# Altium schematic sheet Precharge.SchDoc
size A3; SheetNumber: 7; SheetTotal: 10
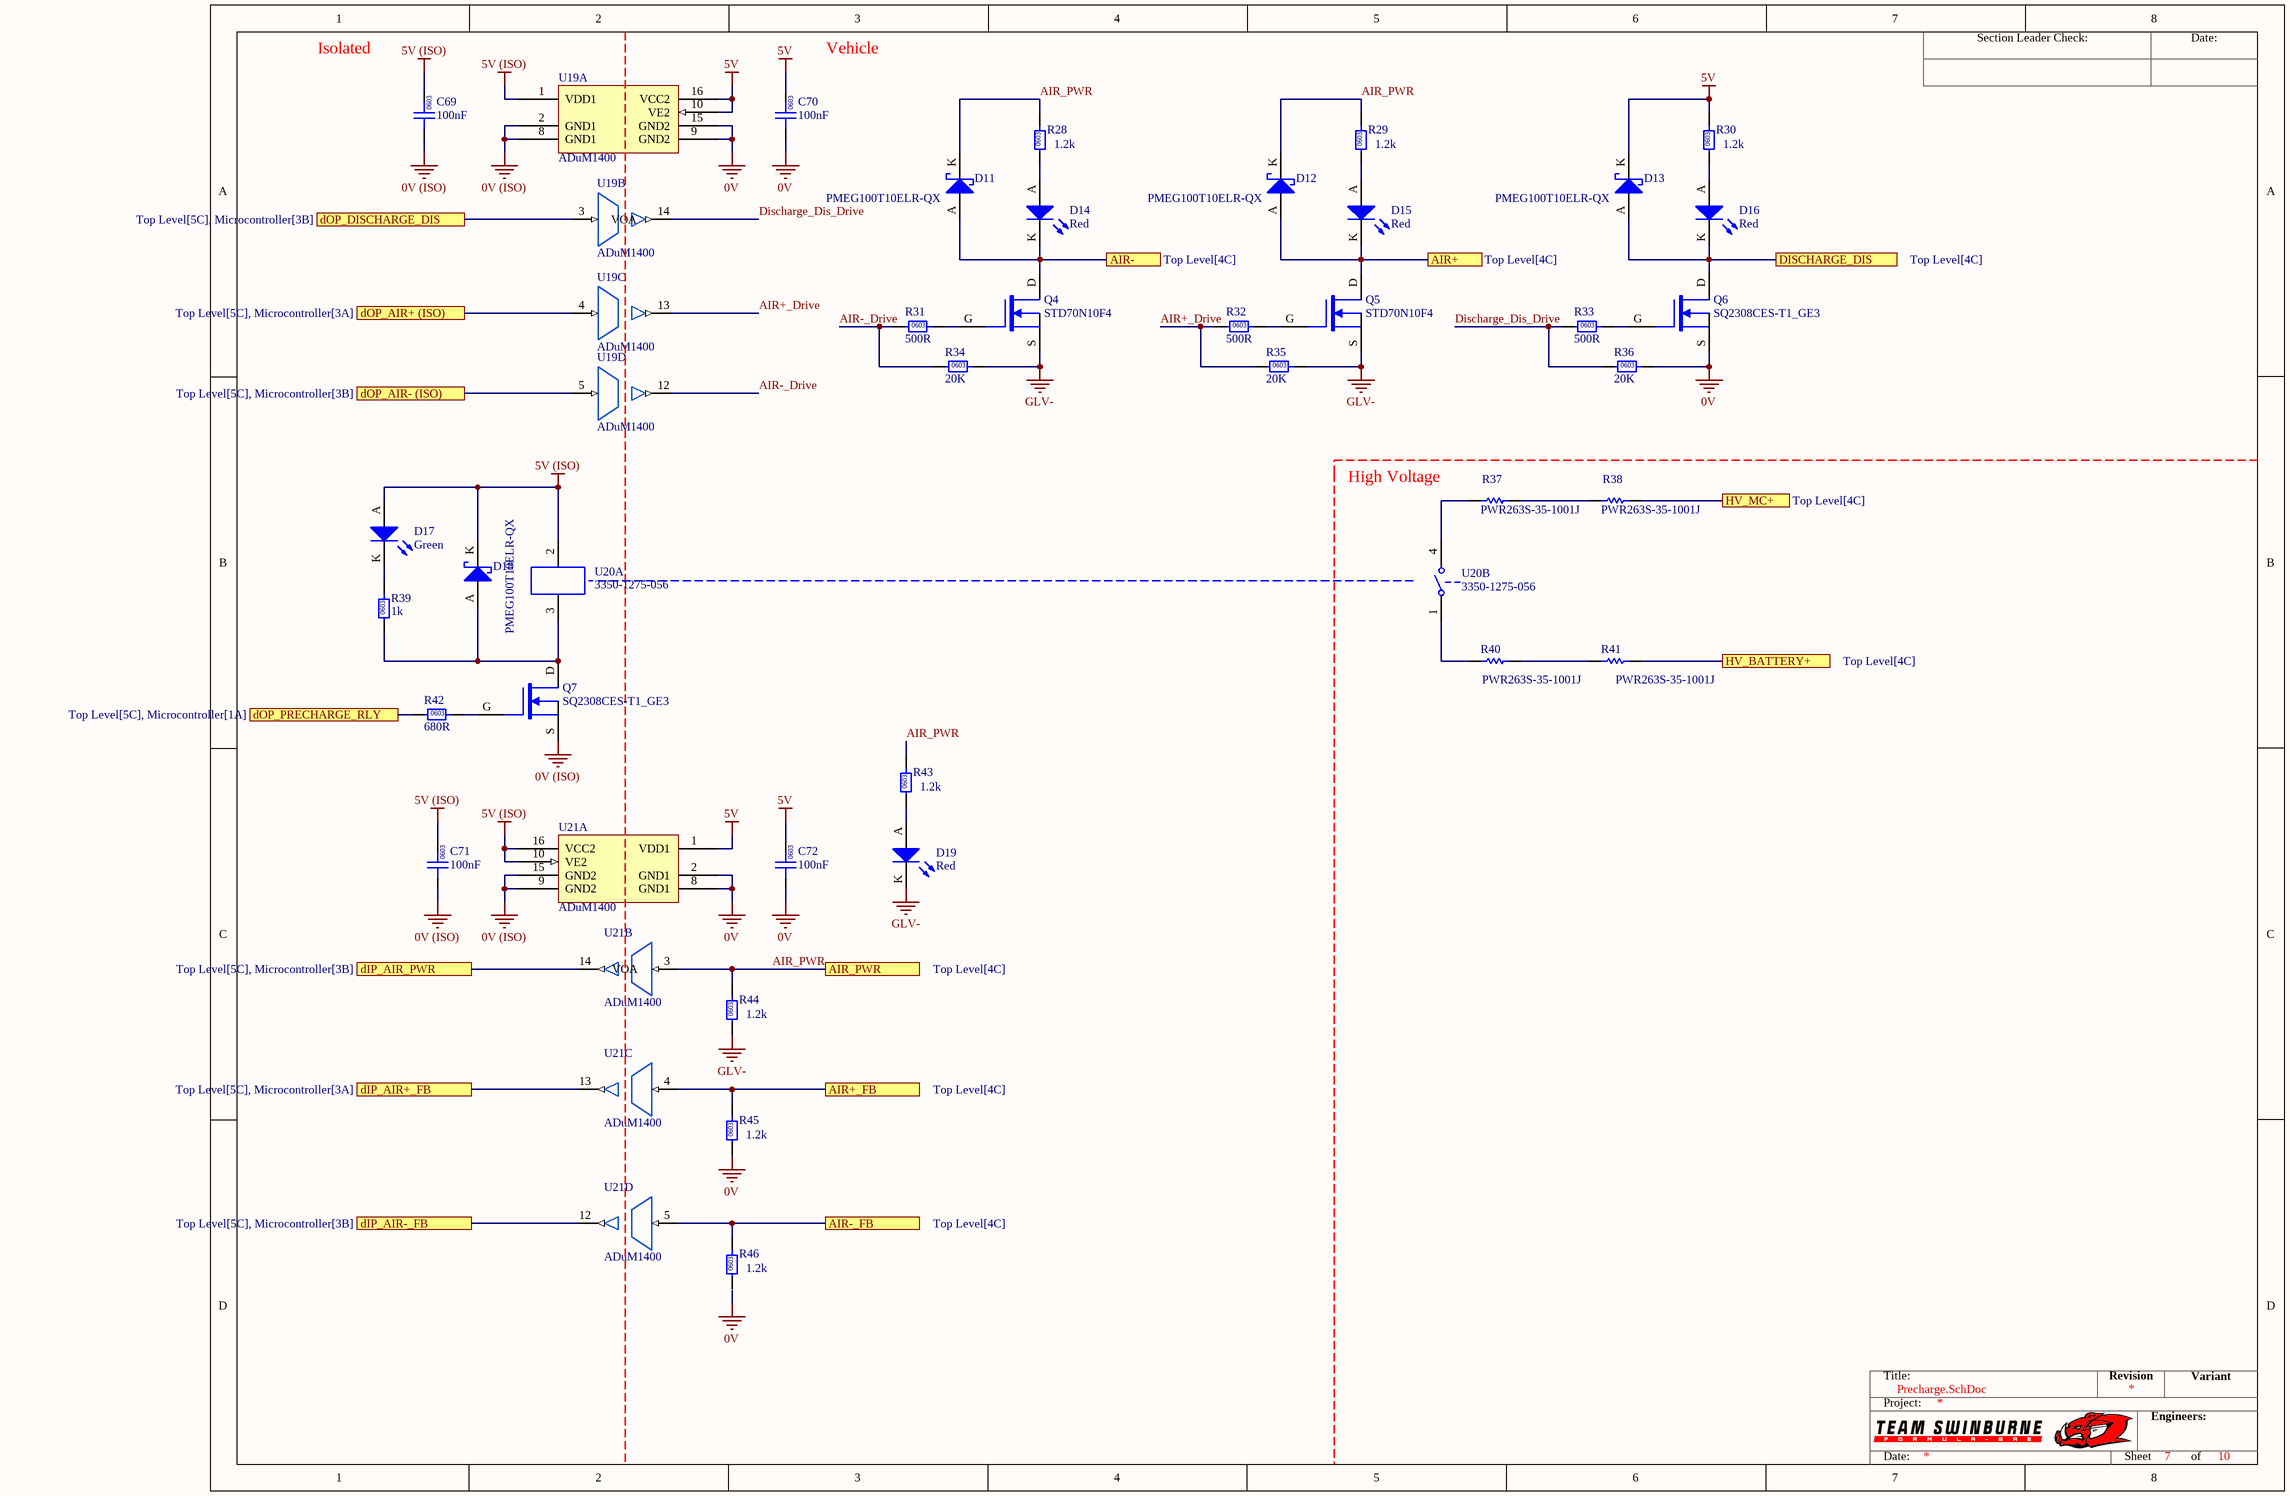
[diagram p0: Precharge.SchDoc]

## Parts
C69  100nF  [0603]
C70  100nF  [0603]
C71  100nF  [0603]
C72  100nF  [0603]
D11  PMEG100T10ELR-QX  [NXP SOD123W]
D12  PMEG100T10ELR-QX  [NXP SOD123W]
D13  PMEG100T10ELR-QX  [NXP SOD123W]
D14  Red  [0805 LED]
D15  Red  [0805 LED]
D16  Red  [0805 LED]
D17  Green  [0805 LED]
D18  PMEG100T10ELR-QX  [NXP SOD123W]
D19  Red  [0805 LED]
Q4  STD70N10F4  [STM TO-252 MOSFET]
Q5  STD70N10F4  [STM TO-252 MOSFET]
Q6  SQ2308CES-T1_GE3  [VSHY SOT-23-3]
Q7  SQ2308CES-T1_GE3  [VSHY SOT-23-3]
R28  1.2k  [0603]
R29  1.2k  [0603]
R30  1.2k  [0603]
R31  500R  [0603]
R32  500R  [0603]
R33  500R  [0603]
R34  20K  [0603]
R35  20K  [0603]
R36  20K  [0603]
R37  PWR263S-35-1001J  [B TO-263]
R38  PWR263S-35-1001J  [B TO-263]
R39  1k  [0603]
R40  PWR263S-35-1001J  [B TO-263]
R41  PWR263S-35-1001J  [B TO-263]
R42  680R  [0603]
R43  1.2k  [0603]
R44  1.2k  [0603]
R45  1.2k  [0603]
R46  1.2k  [0603]
U19  ADuM1400  [AD 16-SOIC]  (parts A,B,C,D of 5)
U20  3350-1275-056  [CI SPST]  (parts A,B of 2)
U21  ADuM1400  [AD 16-SOIC]  (parts A,B,C,D of 5)

## Ports
AIR+ (see Top Level[4C]), AIR+_FB (see Top Level[4C]), AIR- (see Top Level[4C]), AIR-_FB (see Top Level[4C]), AIR_PWR (see Top Level[4C]), dIP_AIR+_FB (see Top Level[5C], Microcontroller[3A]), dIP_AIR-_FB (see Top Level[5C], Microcontroller[3B]), dIP_AIR_PWR (see Top Level[5C], Microcontroller[3B]), DISCHARGE_DIS (see Top Level[4C]), dOP_AIR+ (ISO) (see Top Level[5C], Microcontroller[3A]), dOP_AIR- (ISO) (see Top Level[5C], Microcontroller[3B]), dOP_DISCHARGE_DIS (see Top Level[5C], Microcontroller[3B]), dOP_PRECHARGE_RLY (see Top Level[5C], Microcontroller[1A]), HV_BATTERY+ (see Top Level[4C]), HV_MC+ (see Top Level[4C])

## Nets
0V: C70.1 C72.1 Q6.S R36.2 R45.1 U19.9(GND2) U19.15(GND2) U21.2(GND1) U21.8(GND1)
0V (ISO): C69.1 C71.1 Q7.S U19.2(GND1) U19.8(GND1) U21.9(GND2) U21.15(GND2)
5V: C70.2 C72.2 D13.K R30.2 U19.10(VE2) U19.16(VCC2) U21.1(VDD1)
5V (ISO): C69.2 C71.2 D17.A D18.K U19.1(VDD1) U20.2 U21.10(VE2) U21.16(VCC2)
GLV-: D19.K Q4.S Q5.S R34.2 R35.2 R44.1
AIR+: D12.A D15.K Q5.D ; port AIR+
AIR+_Drive: R32.1 R35.1 U19.13(VOB)
AIR+_FB: R45.2 U21.4(VIB) ; port AIR+_FB
AIR-: D11.A D14.K Q4.D ; port AIR-
AIR-_Drive: R31.1 R34.1 U19.12(VOC)
AIR-_FB: R46.2 U21.5(VIC) ; port AIR-_FB
AIR_PWR: D11.K D12.K R28.2 R29.2 R43.2 R44.2 U21.3(VIA) ; port AIR_PWR
dIP_AIR+_FB: U21.13(VOB) ; port dIP_AIR+_FB
dIP_AIR-_FB: U21.12(VOC) ; port dIP_AIR-_FB
dIP_AIR_PWR: U21.14(VOA) ; port dIP_AIR_PWR
DISCHARGE_DIS: D13.A D16.K Q6.D ; port DISCHARGE_DIS
Discharge_Dis_Drive: R33.1 R36.1 U19.14(VOA)
dOP_AIR+ (ISO): U19.4(VIB) ; port dOP_AIR+ (ISO)
dOP_AIR- (ISO): U19.5(VIC) ; port dOP_AIR- (ISO)
dOP_DISCHARGE_DIS: U19.3(VIA) ; port dOP_DISCHARGE_DIS
dOP_PRECHARGE_RLY: R42.1 ; port dOP_PRECHARGE_RLY
HV_BATTERY+: R41.1 ; port HV_BATTERY+
HV_MC+: R38.2 ; port HV_MC+
NetD14_A: D14.A R28.1
NetD15_A: D15.A R29.1
NetD16_A: D16.A R30.1
NetD17_K: D17.K R39.2
NetD18_A: D18.A Q7.D R39.1 U20.3
NetD19_A: D19.A R43.1
NetQ4_G: Q4.G R31.2
NetQ5_G: Q5.G R32.2
NetQ6_G: Q6.G R33.2
NetQ7_G: Q7.G R42.2
NetR37_1: R37.1 U20.4
NetR37_2: R37.2 R38.1
NetR40_1: R40.1 R41.2
NetR40_2: R40.2 U20.1

Not connected (* = marked no-connect by the designer): R46 1

## Notes on the sheet
- Isolated
- Vehicle
- (near R37) High Voltage
- Section Leader Check:
- Date:
- Title:
- Revision
- Variant
- Project:
- Engineers:
- Sheet
- of
- (in symbol GCM188L81H104KA57D) 0603
- (in symbol RC0603FR-071KL) 0603
- (in symbol RC0603FR-0720KL) 0603
- (in symbol RC0603JR-071K2L) 0603
- (in symbol RC0603JR-13680RL) 0603
- (in symbol RT0603BRD07500RL) 0603

## Library data of the parts
C69-C72 = GCM188L81H104KA57D: Manufacturer: muRata; Rated Voltage: 50V; Tolerance: ±10%; Material: MLCC; Temperature Rating: X8L; Part Number: GCM188L81H104KA57D; Value: 100nF; Digikey Part Number: 490-6049-1-ND
D11-D13 D18 = PMEG100T10ELR-QX: Manufacturer: Nexperia USA Inc.; Forward Voltage: 0.75 V @ 1A; Breakdown Voltage: 100 V; Rated Power: 680 mW; Part Number: PMEG100T10ELR-QX; Digikey Part Number: 1727-PMEG100T10ELR-QXCT-ND
D14-D16 D19 = SML-210LTT86: Red LED Indication - Discrete 1.75V 0805 (2012 Metric); Manufacturer: ROHM Semiconductor; Part Number: SML-210LTT86; Colour: Red; Digikey Part Number: 511-1286-1-ND
D17 = SML-210FTT86: Green LED Indication - Discrete 1.75V 0805 (2012 Metric); Manufacturer: ROHM Semiconductor; Part Number: SML-210FTT86; Colour: Green; Digikey Part Number: 511-1285-1-ND; Digikey Link: https://www.digikey.com/product-detail/en/rohm-semiconductor/SML-210FTT86/511-1285-1-ND/637098
Q4 Q5 = STD70N10F4: N-Channel 100V 60A (Tc) 125W (Tc) Surface Mount DPAK; Manufacturer: STMicroelectronics; Published: 24-Mar-1999; LatestRevisionDate: 29-May-2009; LatestRevisionNote: IPC-7351 Footprint Added.; PackageVersion: Sep-2000; PackageReference: SOT-343; Publisher: Altium Limited; PackageDescription: 4-Pin SOT-343 Package 1.3 mm Pitch, 2.1 mm Lead Span; Part Number: STD70N10F4; Type: N-channel; Rated Power: 125W; Digikey Part Number: 497-8806-2-ND
Q6 Q7 = SQ2308CES-T1_GE3: MOSFET N-CH 60V 2.3A SOT23; Manufacturer: Vishay Siliconix; Type: N-channel; Rated Power: 2W; Published: 24-Mar-1999; LatestRevisionDate: 29-May-2009; LatestRevisionNote: IPC-7351 Footprint Added.; PackageVersion: Sep-2000; PackageReference: SOT-343; Publisher: Altium Limited; PackageDescription: 4-Pin SOT-343 Package 1.3 mm Pitch, 2.1 mm Lead Span; Part Number: SQ2308CES-T1_GE3; Digikey Part Number: SQ2308CES-T1_GE3CT-ND
R28-R30 R43-R46 = RC0603JR-071K2L: Manufacturer: YAGEO; Tolerance: 0.01; Rated Power: 0.1W; Part Number: RC0603JR-071K2L; Value: 1.2k; Material: FR-07; Digikey Part Number: 311-1.2KGRCT-ND
R31-R33 = RT0603BRD07500RL: Manufacturer: YAGEO; Tolerance: 0.01; Rated Power: 0.1W; Part Number: RT0603BRD07500RL; Value: 500R; Material: FR-07; Digikey Part Number: 13-RT0603BRD07500RL-ND
R34-R36 = RC0603FR-0720KL: Manufacturer: YAGEO; Tolerance: 0.01; Rated Power: 0.1W; Part Number: RC0603FR-0720KL; Value: 20K; Material: FR-07; Digikey Part Number: 311-20.0KHRCT-ND
R37 R38 R40 R41 = CMP-037-000402-1: Manufacturer: Bournes Inc; Value: 1k; Rated Voltage: 35W; Tolerance: 0.05; Part Number: PWR263S-35-1001J; Digikey Part Number: PWR263S-35-1001J-ND
R39 = RC0603FR-071KL: Manufacturer: YAGEO; Tolerance: 0.01; Rated Power: 0.1W; Part Number: RC0603FR-071KL; Value: 1k; Material: FR-07; Digikey Part Number: 311-1.00KHRCT-ND
R42 = RC0603JR-13680RL: Manufacturer: YAGEO; Tolerance: 0.01; Rated Power: 0.1W; Part Number: RC0603JR-13680RL; Value: 680R; Material: FR-07; Digikey Part Number: 13-RC0603JR-13680RLCT-ND
U19 U21 = ADuM1400: General Purpose Digital Isolator 2500Vrms 4 Channel 1Mbps 25kV/µs CMTI 16-SOIC (0.295", 7.50mm Width); Manufacturer: Analog Devices; Part Number: ADuM1400; Digikey Part Number: ADUM1400WSRWZ-ND; Digikey Link: https://www.digikey.com/product-detail/en/analog-devices-inc/ADUM1400WSRWZ/ADUM1400WSRWZ-ND/1873713
U20 = 3350-1275-056: RELAY REED HV SPST 200W 3A 5V (NO); Manufacturer: Comus International; Part Number: 3350-1275-056; Digikey Part Number: 1835-1036-ND; Digikey Link: https://www.digikey.com.au/product-detail/en/comus-international/3350-1275-056/1835-1036-ND/7515918